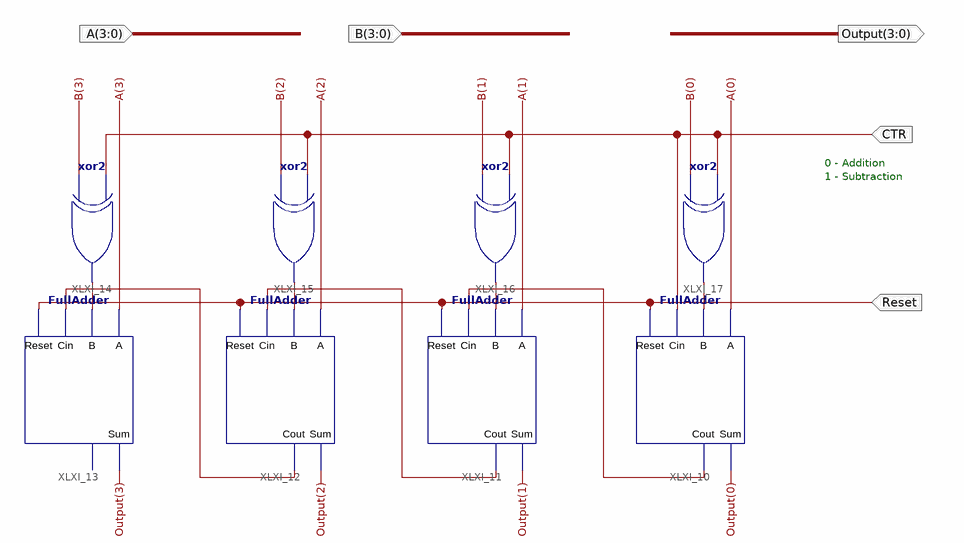
[diagram p0: schematic sheet 1]
// Xilinx ISE schematic AddSubControlLine.sch (artix7) as structural Verilog: 8 symbols, 5 ports
module AddSubControlLine (
  input  CTR,
  input  Reset,
  input  [3:0] A,
  input  [3:0] B,
  output [3:0] Output
);

  wire XLXN_5, XLXN_6, XLXN_7, XLXN_8, XLXN_22, XLXN_24, XLXN_26;

  FullAdder XLXI_10 (.A(A[0]), .B(XLXN_8), .Cin(CTR), .Cout(XLXN_22), .Reset(Reset), .Sum(Output[0]));
  FullAdder XLXI_11 (.A(A[1]), .B(XLXN_7), .Cin(XLXN_22), .Cout(XLXN_24), .Reset(Reset), .Sum(Output[1]));
  FullAdder XLXI_12 (.A(A[2]), .B(XLXN_6), .Cin(XLXN_24), .Cout(XLXN_26), .Reset(Reset), .Sum(Output[2]));
  FullAdder XLXI_13 (.A(A[3]), .B(XLXN_5), .Cin(XLXN_26), .Reset(Reset), .Sum(Output[3]));  // open: Cout
  xor XLXI_14 (XLXN_5, B[3], CTR);
  xor XLXI_15 (XLXN_6, B[2], CTR);
  xor XLXI_16 (XLXN_7, B[1], CTR);
  xor XLXI_17 (XLXN_8, B[0], CTR);

  // Notes on the sheet:
  //   0 - Addition
  //   1 - Subtraction
endmodule
